# Altium project 矩阵键盘.PrjPCB
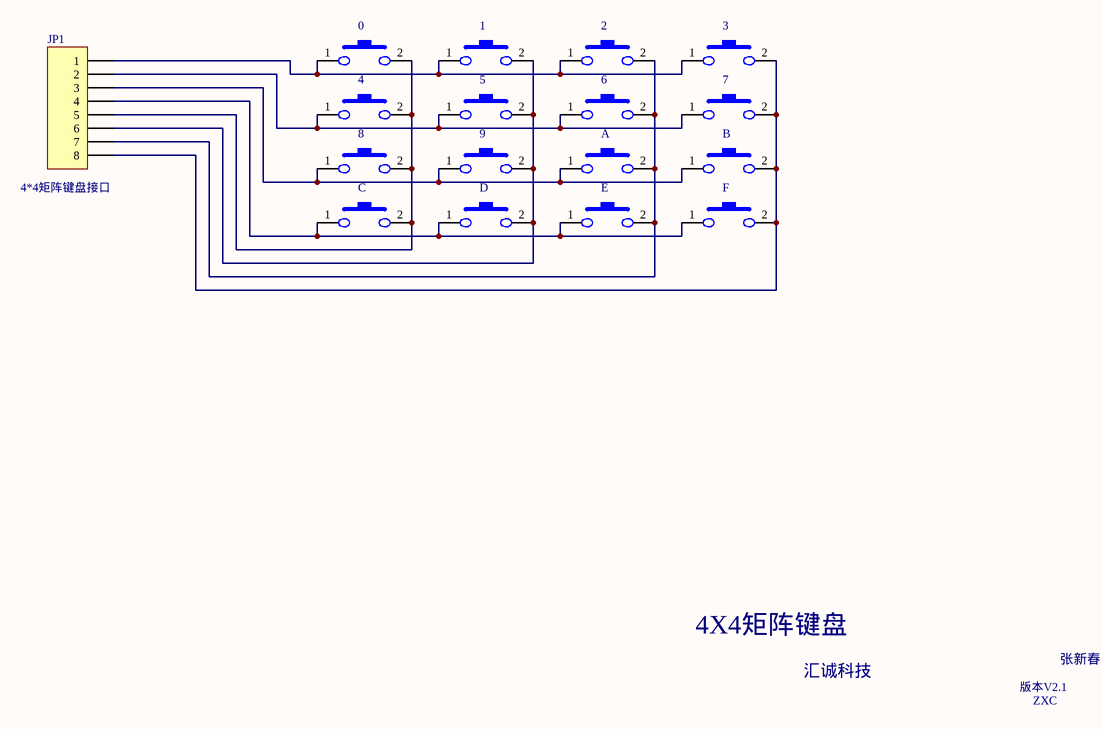
[diagram p0: 矩阵键盘.SchDoc]
1 sheet, 17 parts. Net scope: global (net labels, ports and power ports of the same name join across sheets).
Board file: 矩阵键盘_good.PcbDoc

## Sheet 矩阵键盘.SchDoc
size A4

### Parts
0  key1  [an-6*6]  (value not drawn)
1  key1  [an-6*6]  (value not drawn)
2  key1  [an-6*6]  (value not drawn)
3  key1  [an-6*6]  (value not drawn)
4  key2  [an-6*6]  (value not drawn)
5  key2  [an-6*6]  (value not drawn)
6  key2  [an-6*6]  (value not drawn)
7  key2  [an-6*6]  (value not drawn)
8  key3  [an-6*6]  (value not drawn)
9  key3  [an-6*6]  (value not drawn)
A  key3  [an-6*6]  (value not drawn)
B  key3  [an-6*6]  (value not drawn)
C  key4  [an-6*6]  (value not drawn)
D  key4  [an-6*6]  (value not drawn)
E  key4  [an-6*6]  (value not drawn)
F  key4  [an-6*6]  (value not drawn)
JP1  4*4矩阵键盘接口  [HDR1X8]

### Nets
Net0_1: 0.1 1.1 2.1 3.1 JP1.1
Net0_2: 0.2 4.2 8.2 C.2 JP1.5
Net1_2: 1.2 5.2 9.2 D.2 JP1.6
Net2_2: 2.2 6.2 A.2 E.2 JP1.7
Net3_2: 3.2 7.2 B.2 F.2 JP1.8
Net4_1: 4.1 5.1 6.1 7.1 JP1.2
Net8_1: 8.1 9.1 A.1 B.1 JP1.3
NetC_1: C.1 D.1 E.1 F.1 JP1.4

### Notes on the sheet
- 4X4矩阵键盘
- 汇诚科技
- 版本V2.1
- 张新春
- ZXC

### Library data of the parts
0-9 A B C D E F = key
JP1 = Header 8: Header, 8-Pin; LatestRevisionDate: 17-Jul-2002; LatestRevisionNote: Re-released for DXP Platform.; Publisher: Altium Limited